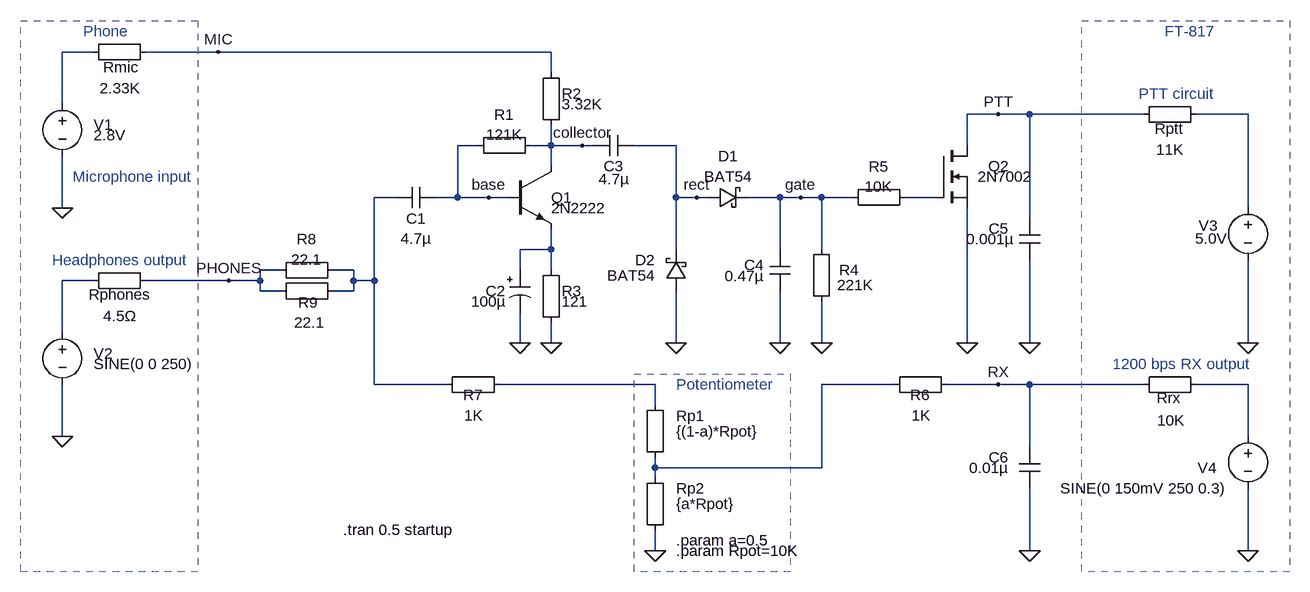
[diagram p0: schematic rtty_interface_rx.asc]
rtty_interface_rx.asc, the LTspice schematic file:
Version 4
SHEET 1 1856 840
WIRE -384 -176 -432 -176
WIRE -192 -176 -304 -176
WIRE 320 -176 -192 -176
WIRE 320 -144 320 -176
WIRE -432 -96 -432 -176
WIRE 1008 -80 960 -80
WIRE 1056 -80 1008 -80
WIRE 1232 -80 1056 -80
WIRE 1392 -80 1312 -80
WIRE 208 -32 176 -32
WIRE 320 -32 320 -64
WIRE 320 -32 288 -32
WIRE 368 -32 320 -32
WIRE 384 -32 368 -32
WIRE 512 -32 448 -32
WIRE 960 -32 960 -80
WIRE 320 0 320 -32
WIRE 80 48 48 48
WIRE 176 48 176 -32
WIRE 176 48 144 48
WIRE 224 48 176 48
WIRE 256 48 224 48
WIRE 512 48 512 -32
WIRE 544 48 512 48
WIRE 560 48 544 48
WIRE 672 48 624 48
WIRE 704 48 672 48
WIRE 736 48 704 48
WIRE 784 48 736 48
WIRE 912 48 864 48
WIRE -432 64 -432 -16
WIRE 1392 64 1392 -80
WIRE 1056 80 1056 -80
WIRE 320 128 320 96
WIRE 320 128 272 128
WIRE 512 128 512 48
WIRE 672 128 672 48
WIRE 736 128 736 48
WIRE -96 160 -128 160
WIRE 16 160 -16 160
WIRE 272 160 272 128
WIRE 320 160 320 128
WIRE -384 176 -432 176
WIRE -176 176 -304 176
WIRE -128 176 -128 160
WIRE -128 176 -176 176
WIRE 16 176 16 160
WIRE 48 176 48 48
WIRE 48 176 16 176
WIRE -128 192 -128 176
WIRE -96 192 -128 192
WIRE 16 192 16 176
WIRE 16 192 -16 192
WIRE -432 256 -432 176
WIRE 272 272 272 224
WIRE 320 272 320 240
WIRE 512 272 512 192
WIRE 672 272 672 192
WIRE 736 272 736 208
WIRE 960 272 960 64
WIRE 1056 272 1056 144
WIRE 1392 272 1392 144
WIRE 48 336 48 176
WIRE 160 336 48 336
WIRE 480 336 240 336
WIRE 848 336 736 336
WIRE 1008 336 928 336
WIRE 1056 336 1008 336
WIRE 1232 336 1056 336
WIRE 1392 336 1312 336
WIRE 480 368 480 336
WIRE -432 416 -432 336
WIRE 1392 416 1392 336
WIRE 1056 432 1056 336
WIRE 480 464 480 448
WIRE 736 464 736 336
WIRE 736 464 480 464
WIRE 480 480 480 464
WIRE 480 592 480 560
WIRE 1056 592 1056 496
WIRE 1392 592 1392 496
FLAG 320 272 0
FLAG -432 64 0
FLAG 272 272 0
FLAG 512 272 0
FLAG 672 272 0
FLAG 736 272 0
FLAG -432 416 0
FLAG -176 176 PHONES
FLAG 704 48 gate
FLAG 960 272 0
FLAG 1392 272 0
FLAG 1008 -80 PTT
FLAG 368 -32 collector
FLAG 544 48 rect
FLAG 1056 272 0
FLAG 1392 592 0
FLAG 1056 592 0
FLAG 480 592 0
FLAG 1008 336 RX
FLAG 224 48 base
FLAG -192 -176 MIC
SYMBOL voltage -432 -112 R0
WINDOW 0 48 48 Left 2
WINDOW 3 48 64 Left 2
WINDOW 123 0 0 Left 2
WINDOW 39 -81 91 Left 2
SYMATTR InstName V1
SYMATTR Value 2.8V
SYMBOL cap 80 64 R270
WINDOW 0 -32 32 VTop 2
WINDOW 3 -32 32 VBottom 2
SYMATTR InstName C1
SYMATTR Value 4.7µ
SYMATTR SpiceLine V=10 Irms=9.29 Rser=0.00646575 Lser=0 mfg="KEMET" pn="C0603C475K8PAC" type="X5R"
SYMBOL Misc\\EuropeanResistor 304 -48 R90
WINDOW 0 -16 56 VBottom 2
WINDOW 3 -16 56 VTop 2
SYMATTR InstName R1
SYMATTR Value 121K
SYMATTR SpiceLine tol=1 pwr=0.1
SYMBOL npn 256 0 R0
WINDOW 0 64 48 Left 2
WINDOW 3 64 64 Left 2
SYMATTR InstName Q1
SYMATTR Value 2N2222
SYMBOL Misc\\EuropeanResistor 304 -160 R0
WINDOW 0 32 48 Left 2
WINDOW 3 32 64 Left 2
SYMATTR InstName R2
SYMATTR Value 3.32K
SYMATTR SpiceLine tol=1 pwr=0.1
SYMBOL Misc\\EuropeanResistor 304 144 R0
WINDOW 0 32 48 Left 2
WINDOW 3 32 64 Left 2
SYMATTR InstName R3
SYMATTR Value 121
SYMATTR SpiceLine tol=1 pwr=0.1
SYMBOL polcap 256 160 R0
WINDOW 0 -6 32 Right 2
WINDOW 3 -5 48 Right 2
SYMATTR InstName C2
SYMATTR Value 100µ
SYMATTR SpiceLine V=6.3 Irms=0 Rser=0.9 Lser=0 mfg="AVX" pn="TAJD107M006" type="Tantalum"
SYMATTR Description Capacitor
SYMATTR Type cap
SYMBOL cap 384 -16 R270
WINDOW 0 0 32 VBottom 2
WINDOW 3 -20 33 VBottom 2
SYMATTR InstName C3
SYMATTR Value 4.7µ
SYMATTR SpiceLine V=10 Irms=9.29 Rser=0.00646575 Lser=0 mfg="KEMET" pn="C0603C475K8PAC" type="X5R"
SYMBOL cap 688 192 R180
WINDOW 0 40 40 Left 2
WINDOW 3 40 23 Left 2
SYMATTR InstName C4
SYMATTR Value 0.47µ
SYMATTR SpiceLine V=6.3 Irms=1.19 Rser=0.0746214 Lser=0 mfg="KEMET" pn="C0603C474K9RAC" type="X7R"
SYMBOL Misc\\EuropeanResistor 720 112 R0
WINDOW 0 43 48 Left 2
WINDOW 3 40 71 Left 2
SYMATTR InstName R4
SYMATTR Value 221K
SYMATTR SpiceLine tol=1 pwr=0.1
SYMBOL schottky 560 64 R270
WINDOW 0 64 32 VTop 2
WINDOW 3 64 32 VBottom 2
SYMATTR InstName D1
SYMATTR Value BAT54
SYMATTR Description Diode
SYMATTR Type diode
SYMBOL schottky 528 192 R180
WINDOW 0 48 48 Left 2
WINDOW 3 48 24 Left 2
SYMATTR InstName D2
SYMATTR Value BAT54
SYMATTR Description Diode
SYMATTR Type diode
SYMBOL voltage -432 240 R0
WINDOW 0 48 48 Left 2
WINDOW 3 48 64 Left 2
WINDOW 123 0 0 Left 2
WINDOW 39 0 0 Left 2
SYMATTR InstName V2
SYMATTR Value SINE(0 0 250)
SYMBOL Misc\\EuropeanResistor -288 -192 R90
WINDOW 0 55 54 VBottom 2
WINDOW 3 56 55 VTop 2
SYMATTR InstName Rmic
SYMATTR Value 2.33K
SYMBOL Misc\\EuropeanResistor 880 32 R90
WINDOW 0 -16 56 VBottom 2
WINDOW 3 -16 56 VTop 2
SYMATTR InstName R5
SYMATTR Value 10K
SYMATTR SpiceLine tol=1 pwr=0.1
SYMBOL nmos 912 -32 R0
WINDOW 0 80 32 Left 2
WINDOW 3 64 48 Left 2
SYMATTR InstName Q2
SYMATTR Value 2N7002
SYMBOL voltage 1392 48 R0
WINDOW 0 -76 43 Left 2
WINDOW 3 -81 63 Left 2
WINDOW 123 0 0 Left 2
WINDOW 39 -81 91 Left 2
SYMATTR InstName V3
SYMATTR Value 5.0V
SYMBOL Misc\\EuropeanResistor 1328 -96 R90
WINDOW 0 54 57 VBottom 2
WINDOW 3 55 56 VTop 2
SYMATTR InstName Rptt
SYMATTR Value 11K
SYMATTR SpiceLine tol=1 pwr=0.1
SYMBOL cap 1072 144 R180
WINDOW 0 48 48 Left 2
WINDOW 3 39 32 Left 2
SYMATTR InstName C5
SYMATTR Value 0.001µ
SYMATTR SpiceLine V=10 Irms=40.9m Rser=5.11126 Lser=0 mfg="KEMET" pn="C0603C102K8RAC" type="X7R"
SYMBOL voltage 1392 400 R0
WINDOW 0 -48 64 Right 2
WINDOW 3 -32 96 Right 2
WINDOW 123 0 0 Left 2
WINDOW 39 0 0 Left 2
SYMATTR InstName V4
SYMATTR Value SINE(0 150mV 250 0.3)
SYMBOL Misc\\EuropeanResistor 1328 320 R90
WINDOW 0 52 58 VBottom 2
WINDOW 3 56 54 VTop 2
SYMATTR InstName Rrx
SYMATTR Value 10K
SYMATTR SpiceLine tol=1 pwr=0.1
SYMBOL cap 1072 496 R180
WINDOW 0 48 48 Left 2
WINDOW 3 48 32 Left 2
SYMATTR InstName C6
SYMATTR Value 0.01µ
SYMATTR SpiceLine V=10 Irms=247m Rser=0.759039 Lser=0 mfg="KEMET" pn="C0603C103K8RAC" type="X7R"
SYMBOL Misc\\EuropeanResistor 944 320 R90
WINDOW 0 48 56 VBottom 2
WINDOW 3 48 55 VTop 2
SYMATTR InstName R6
SYMATTR Value 1K
SYMATTR SpiceLine tol=1 pwr=0.1
SYMBOL Misc\\EuropeanResistor 464 352 R0
WINDOW 0 48 32 Left 2
WINDOW 3 48 56 Left 2
SYMATTR InstName Rp1
SYMATTR Value {(1-a)*Rpot}
SYMATTR SpiceLine tol=1 pwr=0.1
SYMBOL Misc\\EuropeanResistor 256 320 R90
WINDOW 0 48 56 VBottom 2
WINDOW 3 48 55 VTop 2
SYMATTR InstName R7
SYMATTR Value 1K
SYMATTR SpiceLine tol=1 pwr=0.1
SYMBOL Misc\\EuropeanResistor 464 464 R0
WINDOW 0 48 32 Left 2
WINDOW 3 48 56 Left 2
SYMATTR InstName Rp2
SYMATTR Value {a*Rpot}
SYMATTR SpiceLine tol=1 pwr=0.1
SYMBOL Misc\\EuropeanResistor -288 160 R90
WINDOW 0 53 55 VBottom 2
WINDOW 3 55 55 VTop 2
SYMATTR InstName Rphones
SYMATTR Value 4.5Ω
SYMBOL Misc\\EuropeanResistor 0 144 R90
WINDOW 0 -16 56 VBottom 2
WINDOW 3 -16 56 VTop 2
SYMATTR InstName R8
SYMATTR Value 22.1
SYMATTR SpiceLine tol=1 pwr=0.1
SYMBOL Misc\\EuropeanResistor 0 176 R90
WINDOW 0 49 54 VBottom 2
WINDOW 3 49 52 VTop 2
SYMATTR InstName R9
SYMATTR Value 22.1
SYMATTR SpiceLine tol=1 pwr=0.1
TEXT 0 560 Left 2 !.tran 0.5 startup
TEXT 1264 -208 Left 2 ;FT-817
TEXT -400 -208 Left 2 ;Phone
TEXT -416 16 Left 2 ;Microphone input
TEXT -448 144 Left 2 ;Headphones output
TEXT 512 576 Left 2 !.param a=0.5
TEXT 512 592 Left 2 !.param Rpot=10K
TEXT 1184 304 Left 2 ;1200 bps RX output
TEXT 1224 -112 Left 2 ;PTT circuit
TEXT 512 336 Left 2 ;Potentiometer
RECTANGLE Normal -224 624 -496 -224 1
RECTANGLE Normal 1456 624 1136 -224 1
RECTANGLE Normal 688 624 448 320 2

The netlist it stands for:
* rtty_interface_rx.asc
V1 N001 0 2.8V
C1 N003 base 4.7µ V=10 Irms=9.29 Rser=0.00646575 Lser=0 mfg="KEMET" pn="C0603C475K8PAC" type="X5R"
R1 collector base 121K tol=1 pwr=0.1
Q1 collector base N005 0 2N2222
R2 MIC collector 3.32K tol=1 pwr=0.1
R3 N005 0 121 tol=1 pwr=0.1
C2 N005 0 100µ V=6.3 Irms=0 Rser=0.9 Lser=0 mfg="AVX" pn="TAJD107M006" type="Tantalum"
C3 collector rect 4.7µ V=10 Irms=9.29 Rser=0.00646575 Lser=0 mfg="KEMET" pn="C0603C475K8PAC" type="X5R"
C4 0 gate 0.47µ V=6.3 Irms=1.19 Rser=0.0746214 Lser=0 mfg="KEMET" pn="C0603C474K9RAC" type="X7R"
R4 gate 0 221K tol=1 pwr=0.1
D1 rect gate BAT54
D2 0 rect BAT54
V2 N006 0 SINE(0 0 250)
Rmic MIC N001 2.33K
R5 N004 gate 10K tol=1 pwr=0.1
M§Q2 PTT N004 0 0 2N7002
V3 N002 0 5.0V
Rptt N002 PTT 11K tol=1 pwr=0.1
C5 0 PTT 0.001µ V=10 Irms=40.9m Rser=5.11126 Lser=0 mfg="KEMET" pn="C0603C102K8RAC" type="X7R"
V4 N009 0 SINE(0 150mV 250 0.3)
Rrx N009 RX 10K tol=1 pwr=0.1
C6 0 RX 0.01µ V=10 Irms=247m Rser=0.759039 Lser=0 mfg="KEMET" pn="C0603C103K8RAC" type="X7R"
R6 RX N008 1K tol=1 pwr=0.1
Rp1 N007 N008 {(1-a)*Rpot} tol=1 pwr=0.1
R7 N007 N003 1K tol=1 pwr=0.1
Rp2 N008 0 {a*Rpot} tol=1 pwr=0.1
Rphones PHONES N006 4.5Ω
R8 N003 PHONES 22.1 tol=1 pwr=0.1
R9 N003 PHONES 22.1 tol=1 pwr=0.1
.model D D
.lib standard.dio
.model NPN NPN
.model PNP PNP
.lib standard.bjt
.model NMOS NMOS
.model PMOS PMOS
.lib standard.mos
.tran 0.5 startup
* FT-817
* Phone
* Microphone input
* Headphones output
.param a=0.5
.param Rpot=10K
* 1200 bps RX output
* PTT circuit
* Potentiometer
.backanno
.end